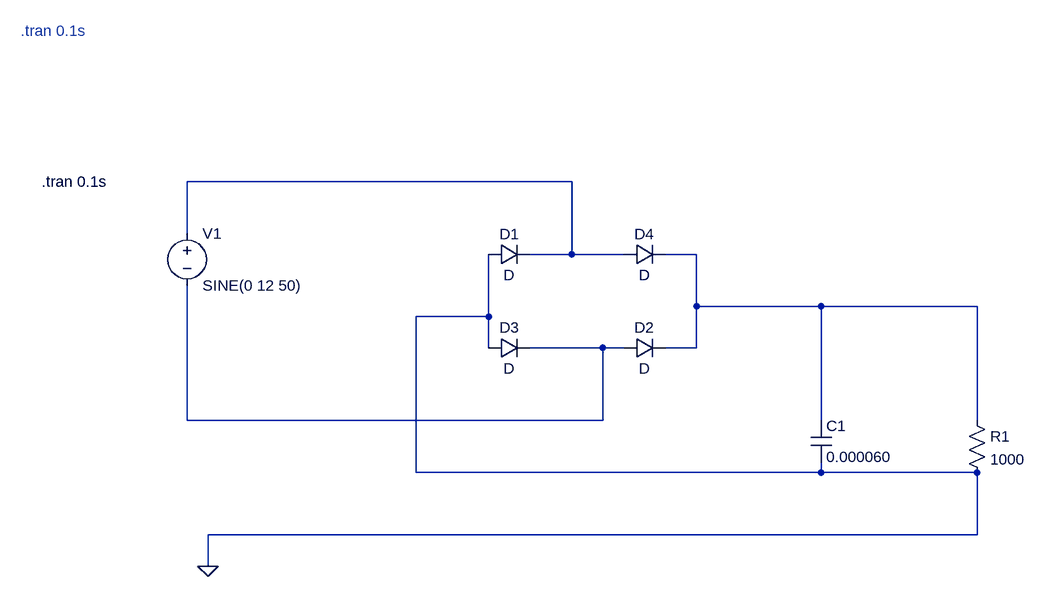
[diagram p0: schematic bridge_rectifier.asc]
bridge_rectifier.asc, the LTspice schematic file:
Version 4.1
SHEET 1 880 680
WIRE 96 48 -496 48
WIRE -496 128 -496 48
WIRE 96 160 96 48
WIRE 96 160 32 160
WIRE 176 160 96 160
WIRE 288 160 240 160
WIRE 288 240 288 160
WIRE 480 240 288 240
WIRE 720 240 480 240
WIRE -32 256 -32 160
WIRE -32 256 -144 256
WIRE -32 304 -32 256
WIRE 144 304 32 304
WIRE 176 304 144 304
WIRE 288 304 288 240
WIRE 288 304 240 304
WIRE -496 416 -496 208
WIRE 144 416 144 304
WIRE 144 416 -496 416
WIRE 480 416 480 240
WIRE 720 416 720 240
WIRE -144 496 -144 256
WIRE 480 496 480 480
WIRE 480 496 -144 496
WIRE 720 496 480 496
WIRE 720 592 720 496
WIRE 720 592 -464 592
WIRE -464 640 -464 592
FLAG -464 640 0
SYMBOL diode -32 144 M90
WINDOW 0 0 32 VBottom 2
WINDOW 3 32 32 VTop 2
SYMATTR InstName D1
SYMBOL diode 176 320 R270
WINDOW 0 32 32 VTop 2
WINDOW 3 0 32 VBottom 2
SYMATTR InstName D2
SYMBOL diode -32 320 R270
WINDOW 0 32 32 VTop 2
WINDOW 3 0 32 VBottom 2
SYMATTR InstName D3
SYMBOL diode 176 176 R270
WINDOW 0 32 32 VTop 2
WINDOW 3 0 32 VBottom 2
SYMATTR InstName D4
SYMBOL res 704 400 R0
SYMATTR InstName R1
SYMATTR Value 1000
SYMBOL cap 464 416 R0
SYMATTR InstName C1
SYMATTR Value 0.000060
SYMBOL voltage -496 112 R0
WINDOW 123 0 0 Left 0
WINDOW 39 0 0 Left 0
SYMATTR InstName V1
SYMATTR Value SINE(0 12 50)
TEXT -720 48 Left 2 !.tran 0.1s
TEXT -752 -184 Left 2 ;.tran 0.1s

The netlist it stands for:
* bridge_rectifier.asc
D1 0 N001 D
D2 N003 N002 D
D3 0 N003 D
D4 N001 N002 D
R1 N002 0 1000
C1 N002 0 0.000060
V1 N001 N003 SINE(0 12 50)
.model D D
.lib standard.dio
.tran 0.1s
* .tran 0.1s
.backanno
.end